# Altium schematic sheet 15_PowerSupply.SchDoc: Board power supply (part 1 of 3)
size A3; Organization: Lime Microsystems; Address1: Surrey Tech Centre; Address2: Guildford GU2 7YG; Address3: Surrey; Address4: United Kingdom; Revision: v2.0; SheetNumber: 15; SheetTotal: 15
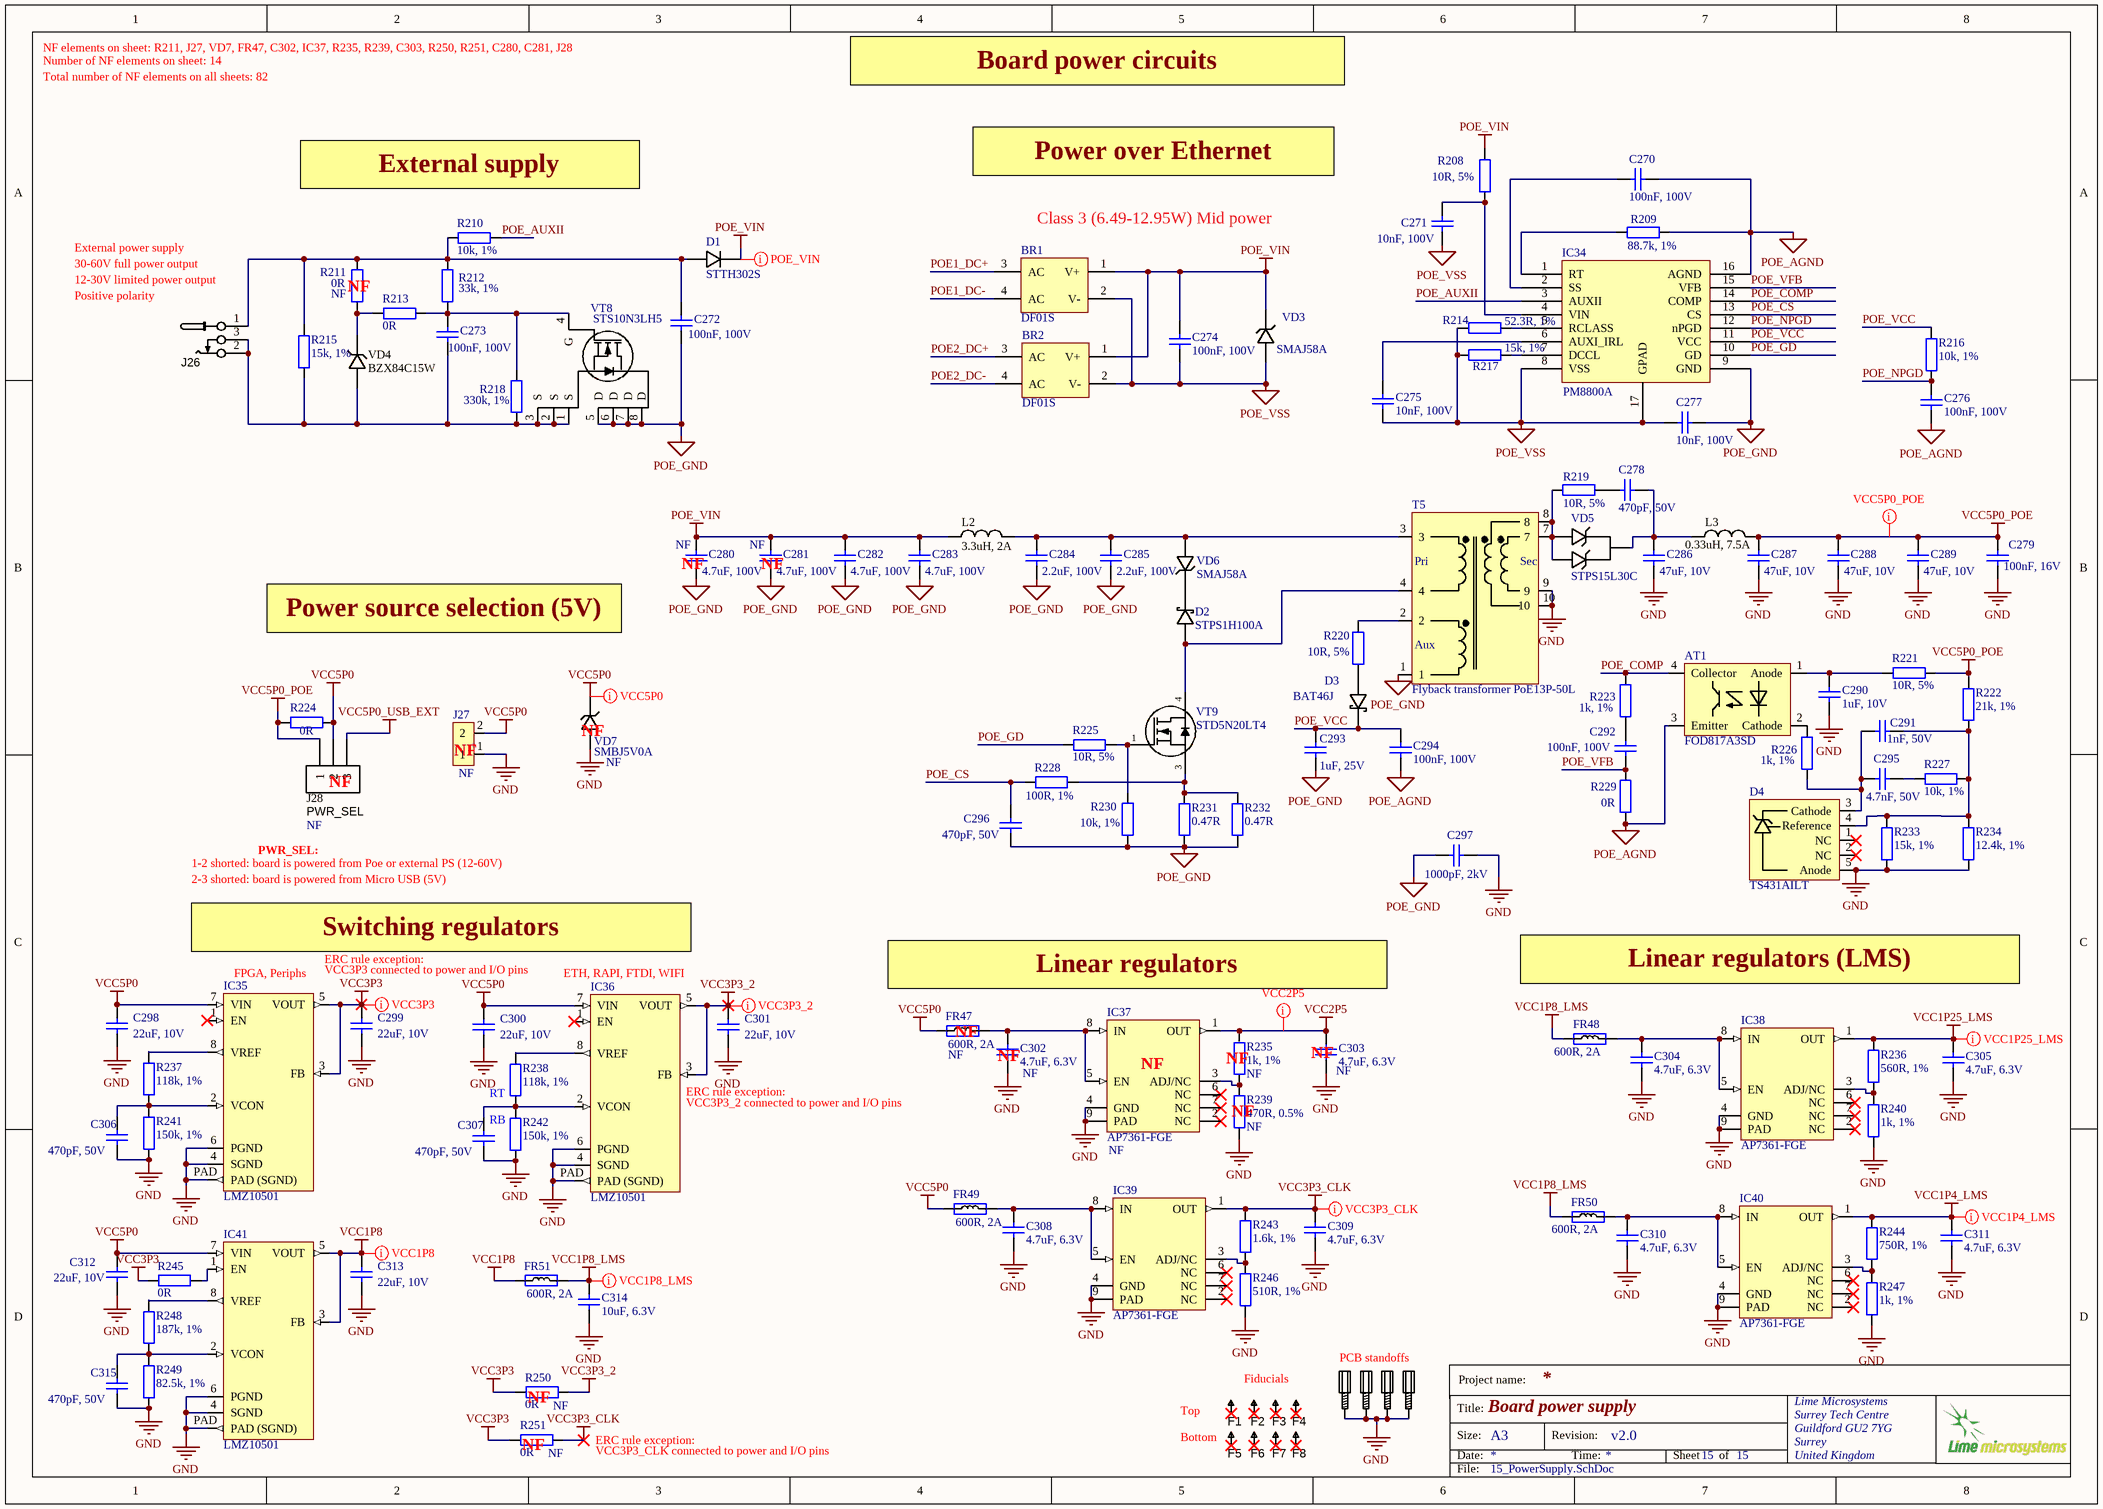
[diagram p0: 15_PowerSupply.SchDoc]

## Parts
AT1  FOD817A3SD  [FOD817A3SD_optoisolator_FOD817]
BR1  DF01S  [DF01S-T_RECTIFIER_BRIDGE_v1]
BR2  DF01S  [DF01S-T_RECTIFIER_BRIDGE_v1]
C270  100nF, 100V  [CAP0805]
C271  10nF, 100V  [CAP0603]
C272  100nF, 100V  [CAP0805]
C273  100nF, 100V  [CAP0805]
C274  100nF, 100V  [CAP0805]
C275  10nF, 100V  [CAP0603]
C276  100nF, 100V  [CAP0805]
C277  10nF, 100V  [CAP0603]
C278  470pF, 50V  [CAP0402]
C279  100nF, 16V  [CAP0402]
C280  4.7uF, 100V  Assembly Info: NF  [CAP1210]
C281  4.7uF, 100V  Assembly Info: NF  [CAP1210]
C282  4.7uF, 100V  [CAP1210]
C283  4.7uF, 100V  [CAP1210]
C284  2.2uF, 100V  [CAP1206]
C285  2.2uF, 100V  [CAP1206]
C286  47uF, 10V  [CAP1206]
C287  47uF, 10V  [CAP1206]
C288  47uF, 10V  [CAP1206]
C289  47uF, 10V  [CAP1206]
C290  1uF, 10V  [CAP0402]
C291  1nF, 50V  [CAP0402]
C292  100nF, 100V  [CAP0805]
C293  1uF, 25V  [CAP0603]
C294  100nF, 100V  [CAP0805]
C295  4.7nF, 50V  [CAP0402]
C296  470pF, 50V  [CAP0402]
C297  1000pF, 2kV  [CAP1812]
C298  22uF, 10V  [CAP0603]
C299  22uF, 10V  [CAP0603]
C300  22uF, 10V  [CAP0603]
C301  22uF, 10V  [CAP0603]
C302  4.7uF, 6.3V  Assembly Info: NF  [CAP0402]
C303  4.7uF, 6.3V  Assembly Info: NF  [CAP0402]
C304  4.7uF, 6.3V  [CAP0402]
C305  4.7uF, 6.3V  [CAP0402]
C306  470pF, 50V  [CAP0402]
C307  470pF, 50V  [CAP0402]
C308  4.7uF, 6.3V  [CAP0402]
C309  4.7uF, 6.3V  [CAP0402]
C310  4.7uF, 6.3V  [CAP0402]
C311  4.7uF, 6.3V  [CAP0402]
C312  22uF, 10V  [CAP0603]
C313  22uF, 10V  [CAP0603]
C314  10uF, 6.3V  [CAP0603]
C315  470pF, 50V  [CAP0402]
D1  STTH302S  [STTH302S_diode]
D2  STPS1H100A  [STPS1H100A_shottky_diode]
D3  BAT46J  [BAT46JFILM_shottky_diode_SOD323]
D4  TS431AILT  [SOT23-5]
F1  Fiducial  [Fiducial]  (value not drawn)
F2  Fiducial  [Fiducial]  (value not drawn)
F3  Fiducial  [Fiducial]  (value not drawn)
F4  Fiducial  [Fiducial]  (value not drawn)
F5  Fiducial  [Fiducial]  (value not drawn)
F6  Fiducial  [Fiducial]  (value not drawn)
F7  Fiducial  [Fiducial]  (value not drawn)
F8  Fiducial  [Fiducial]  (value not drawn)
FR47  600R, 2A  Assembly Info: NF  [RES0805]
FR48  600R, 2A  [RES0805]
FR49  600R, 2A  [RES0805]
FR50  600R, 2A  [RES0805]
FR51  600R, 2A  [RES0805]
IC34  PM8800A  [PM8800A_HTSSOP16]
IC35  LMZ10501  [LMZ10501]
IC36  LMZ10501  [LMZ10501]
IC37  AP7361-FGE  Assembly Info: NF  [AP7361]
IC38  AP7361-FGE  [AP7361]
IC39  AP7361-FGE  [AP7361]
IC40  AP7361-FGE  [AP7361]
IC41  LMZ10501  [LMZ10501]
J26  CONN_PWR_JACK_2.1x5.5mm  [CONN_PWR_JACK_v2]  (value not drawn)
J27  Assembly Info: NF  [HDR_1x2_NO_SILK]
J28  PWR_SEL  Assembly Info: NF  [HDR_1x3_NO_SILK]
L2  3.3uH, 2A  [NRS4018T3R3MDGJ_inductor]
L3  0.33uH, 7.5A  [PA4336.331NLT_inductor]
MECH5  # pcs.  [PCB_standoff]  (value not drawn)
MECH6  # pcs.  [PCB_standoff]  (value not drawn)
MECH7  # pcs.  [PCB_standoff]  (value not drawn)
MECH8  # pcs.  [PCB_standoff]  (value not drawn)
R208  10R, 5%  [RES0402]
R209  88.7k, 1%  [RES0402]
R210  10k, 1%  [RES0402]
R211  0R  Assembly Info: NF  [RES0402]
R212  33k, 1%  [RES0402]
R213  0R  [RES0402]
R214  52.3R, 1%  [RES0805]
R215  15k, 1%  [RES0402]
R216  10k, 1%  [RES0402]
R217  15k, 1%  [RES0402]
R218  330k, 1%  [RES0402]
R219  10R, 5%  [RES0402]
R220  10R, 5%  [RES0402]
R221  10R, 5%  [RES0402]
R222  21k, 1%  [RES0402]
R223  1k, 1%  [RES0402]
R224  0R  [RES0805]
R225  10R, 5%  [RES0402]
R226  1k, 1%  [RES0402]
R227  10k, 1%  [RES0402]
R228  100R, 1%  [RES0402]
R229  0R  [RES0402]
R230  10k, 1%  [RES0402]
R231  0.47R  [RES0805]
R232  0.47R  [RES0805]
R233  15k, 1%  [RES0402]
R234  12.4k, 1%  [RES0402]
R235  1k, 1%  Assembly Info: NF  [RES0402]
R236  560R, 1%  [RES0402]
R237  118k, 1%  [RES0402]
R238  118k, 1%  [RES0402]
R239  470R, 0.5%  Assembly Info: NF  [RES0402]
R240  1k, 1%  [RES0402]
R241  150k, 1%  [RES0402]
R242  150k, 1%  [RES0402]
R243  1.6k, 1%  [RES0402]
R244  750R, 1%  [RES0402]
R245  0R  [RES0402]
R246  510R, 1%  [RES0402]
R247  1k, 1%  [RES0402]
R248  187k, 1%  [RES0402]
R249  82.5k, 1%  [RES0402]
R250  0R  Assembly Info: NF  [RES0805]
R251  0R  Assembly Info: NF  [RES0805]
T5  Flyback transformer PoE13P-50L  [PoE13P-50L_Flyback_transformer]
VD3  SMAJ58A  [SMAJ58A_shottky_diode]
VD4  BZX84C15W  [SOT323]
VD5  STPS15L30C  [STPS15L30C_shottky_rectifier_DPAK]
VD6  SMAJ58A  [SMAJ58A_shottky_diode]
VD7  SMBJ5V0A  Assembly Info: NF  [SMAJ12CA-13-F]
VT8  STS10N3LH5  [STS10P3LLH6_PMOS_SO8]
VT9  STD5N20LT4  [STD5N20LT4_NMOS_DPAK]

## Nets
GND: C279.1 C286.1 C287.1 C288.1 C289.1 C290.1 C297.1 C298.1 C299.1 C300.1 C301.1 C302.1 C303.1 C304.1 C305.1 C306.2 C307.2 C308.1 C309.1 C310.1 C311.1 C312.1 C313.1 C314.1 C315.2 D4.5(Anode) IC35.4(SGND) IC35.6(PGND) IC35.PAD(PAD_(SGND)) IC36.4(SGND) IC36.6(PGND) IC36.PAD(PAD_(SGND)) IC37.4(GND) IC37.9(PAD) IC38.4(GND) IC38.9(PAD) IC39.4(GND) IC39.9(PAD) IC40.4(GND) IC40.9(PAD) IC41.4(SGND) IC41.6(PGND) IC41.PAD(PAD_(SGND)) J27.1 MECH5.MH1 MECH6.MH1 MECH7.MH1 MECH8.MH1 R233.1 R234.1 R239.2 R240.1 R241.1 R242.1 R246.2 R247.1 R249.1 T5.9 T5.10 VD7.A
POE_AGND: AT1.3(Emitter) C270.1 C276.1 C294.1 IC34.16(AGND) R209.1 R229.2
POE_GND: C272.2 C277.1 C280.1 C281.1 C282.1 C283.1 C284.1 C285.1 C293.1 C296.2 C297.2 IC34.9(GND) R230.2 R231.2 R232.2 T5.1 VT8.5(D) VT8.6(D) VT8.7(D) VT8.8(D)
POE_VIN: BR1.1(V+) BR2.1(V+) C274.2 C280.2 C281.2 C282.2 C283.2 D1.C L2.1 R208.2 VD3.A
POE_VSS: BR1.2(V-) BR2.2(V-) C271.1 C274.1 C275.1 C277.2 IC34.8(VSS) IC34.17(GPAD) R214.2 R217.2 VD3.K
VCC1P4_LMS: C311.2 IC40.1(OUT) R244.1
VCC1P8: C313.2 FR51.1 IC41.3(FB) IC41.5(VOUT)
VCC1P8_LMS: C314.2 FR48.1 FR50.1 FR51.2
VCC1P25_LMS: C305.2 IC38.1(OUT) R236.2
VCC2P5: C303.2 IC37.1(OUT) R235.2
VCC3P3: C299.2 IC35.3(FB) IC35.5(VOUT) R245.1 R250.2 R251.2
VCC3P3_2: C301.2 IC36.3(FB) IC36.5(VOUT) R250.1
VCC3P3_CLK: C309.2 IC39.1(OUT) R243.2 R251.1
VCC5P0: C298.2 C300.2 C312.2 FR47.1 FR49.1 IC35.7(VIN) IC36.7(VIN) IC41.7(VIN) J27.2 J28.2 R224.1 VD7.K
VCC5P0_POE: C279.2 C287.2 C288.2 C289.2 J28.1 L3.2 R221.1 R222.2 R224.2
VCC5P0_USB_EXT: J28.3
POE1_DC+: BR1.3(AC)
POE1_DC-: BR1.4(AC)
POE2_DC+: BR2.3(AC)
POE2_DC-: BR2.4(AC)
POE_AUXII: IC34.3(AUXII) R210.2
POE_COMP: AT1.4(Collector) IC34.14(COMP) R223.2
POE_CS: C296.1 IC34.13(CS) R228.1
POE_GD: IC34.10(GD) R225.1
POE_NPGD: C276.2 IC34.12(nPGD) R216.1
POE_VCC: C293.2 C294.2 D3.C IC34.11(VCC) R216.2
POE_VFB: C292.1 IC34.15(VFB) R229.1
NetAT1_1: AT1.1(Anode) C290.2 R221.2
NetAT1_2: AT1.2(Cathode) R226.2
NetC270_2: C270.2 IC34.2(SS)
NetC271_2: C271.2 IC34.4(VIN) R208.1
NetC272_1: C272.1 D1.A J26.1 R210.1 R211.1 R212.1 R215.2
NetC273_1: C273.1 J26.2 J26.3 R215.1 R218.2 VD4.1(A) VT8.1(S) VT8.2(S) VT8.3(S)
NetC273_2: C273.2 R212.2 R213.1 R218.1 VT8.4(G)
NetC275_2: C275.2 IC34.6(AUXI_IRL)
NetC278_1: C278.1 R219.2
NetC278_2: C278.2 C286.2 L3.1 VD5.4(C)
NetC284_2: C284.2 C285.2 L2.2 T5.3 VD6.K
NetC291_1: C291.1 D4.4(Reference) R222.1 R227.2 R233.2 R234.2
NetC291_2: C291.2 C295.2 D4.3(Cathode) R226.1
NetC292_2: C292.2 R223.1
NetC295_1: C295.1 R227.1
NetC302_2: C302.2 FR47.2 IC37.5(EN) IC37.8(IN)
NetC304_2: C304.2 FR48.2 IC38.5(EN) IC38.8(IN)
NetC306_1: C306.1 IC35.2(VCON) R237.1 R241.2
NetC307_1: C307.1 IC36.2(VCON) R238.1 R242.2
NetC308_2: C308.2 FR49.2 IC39.5(EN) IC39.8(IN)
NetC310_2: C310.2 FR50.2 IC40.5(EN) IC40.8(IN)
NetC315_1: C315.1 IC41.2(VCON) R248.1 R249.2
NetD2_A: D2.A T5.4 VT9.4(D)
NetD2_C: D2.C VD6.A
NetD3_A: D3.A R220.1
NetIC34_1: IC34.1(RT) R209.2
NetIC34_5: IC34.5(RCLASS) R214.1
NetIC34_7: IC34.7(DCCL) R217.1
NetIC35_8: IC35.8(VREF) R237.2
NetIC36_8: IC36.8(VREF) R238.2
NetIC37_3: IC37.3(ADJ/NC) R235.1 R239.1
NetIC38_3: IC38.3(ADJ/NC) R236.1 R240.2
NetIC39_3: IC39.3(ADJ/NC) R243.1 R246.1
NetIC40_3: IC40.3(ADJ/NC) R244.2 R247.2
NetIC41_1: IC41.1(EN) R245.2
NetIC41_8: IC41.8(VREF) R248.2
NetR211_2: R211.2 R213.2 VD4.3(C)
NetR219_1: R219.1 T5.7 T5.8 VD5.1(A1) VD5.3(A2)
NetR220_2: R220.2 T5.2
NetR225_2: R225.2 R230.1 VT9.1(G)
NetR228_2: R228.2 R231.1 R232.1 VT9.3(S)

Not connected (* = marked no-connect by the designer): D4 1(NC)* 2(NC)*; F1 1*; F2 1*; F3 1*; F4 1*; F5 1*; F6 1*; F7 1*; F8 1*; IC35 1(EN)*; IC36 1(EN)*; IC37 2(NC)* 6(NC)* 7(NC)*; IC38 2(NC)* 6(NC)* 7(NC)*; IC39 2(NC)* 6(NC)* 7(NC)*; IC40 2(NC)* 6(NC)* 7(NC)*

## Layout directives
net class VCC1P4_LMS: VCC1P4_LMS
net class VCC1P25_LMS: VCC1P25_LMS
net class VCC1P8_LMS: VCC1P8_LMS
net class VCC3P3_CLK: VCC3P3_CLK
net class VCC2P5: VCC2P5
net class VCC3P3_2: VCC3P3_2
net class POE_VIN: POE_VIN
net class VCC5P0_POE: VCC5P0_POE
net class VCC3P3: VCC3P3
net class VCC1P8: VCC1P8
net class VCC5P0: VCC5P0

## Notes on the sheet
- NF elements on sheet: R211, J27, VD7, FR47, C302, IC37, R235, R239, C303, R250, R251, C280, C281, J28
- Number of NF elements on sheet: 14
- Total number of NF elements on all sheets: 82
- Board power circuits
- Power over Ethernet
- (near R210) External supply
- IEEE 802.3af compliant
- (near BR1) Class 3 (6.49-12.95W) Mid power
- (near J26) Positive polarity
- External power supply
- (near J26) 12-30V limited power output
- 30-60V full power output
- (near R211) NF
- (near C280) NF
- (near C281) NF
- Power source selection (5V)
- (near J28) NF
- (near J27) NF
- (near VD7) NF
- PWR_SEL:
- 1-2 shorted: board is powered from Poe or external PS (12-60V)
- 2-3 shorted: board is powered from Micro USB (5V)
- Switching regulators
- (near IC35) FPGA, Periphs
- ERC rule exception:
- VCC3P3 connected to power and I/O pins
- (near IC36) ETH, RAPI, FTDI, WIFI
- Linear regulators
- Linear regulators (LMS)
- (near FR47) NF
- (near C303) NF
- RT
- (near C307) RB
- (near IC36) ERC rule exception:
- (near IC36) VCC3P3_2 connected to power and I/O pins
- (near C302) NF
- (near IC37) NF
- (near R235) NF
- (near R239) NF
- Fiducials
- PCB standoffs
- (near R251) NF
- (near R250) NF
- VCC3P3_CLK connected to power and I/O pins
- Top
- (near F5) Bottom
- Project name:
- Title:
- Size:
- Date:
- A3
- Revision:
- Time:
- Sheet
- of
- File:
- (in symbol PoE13P-50L_Flyback_transformer_1) Pri; Sec; Aux